# Altium schematic sheet ROBOTICARM.SchDoc
size 297 x 138 mm
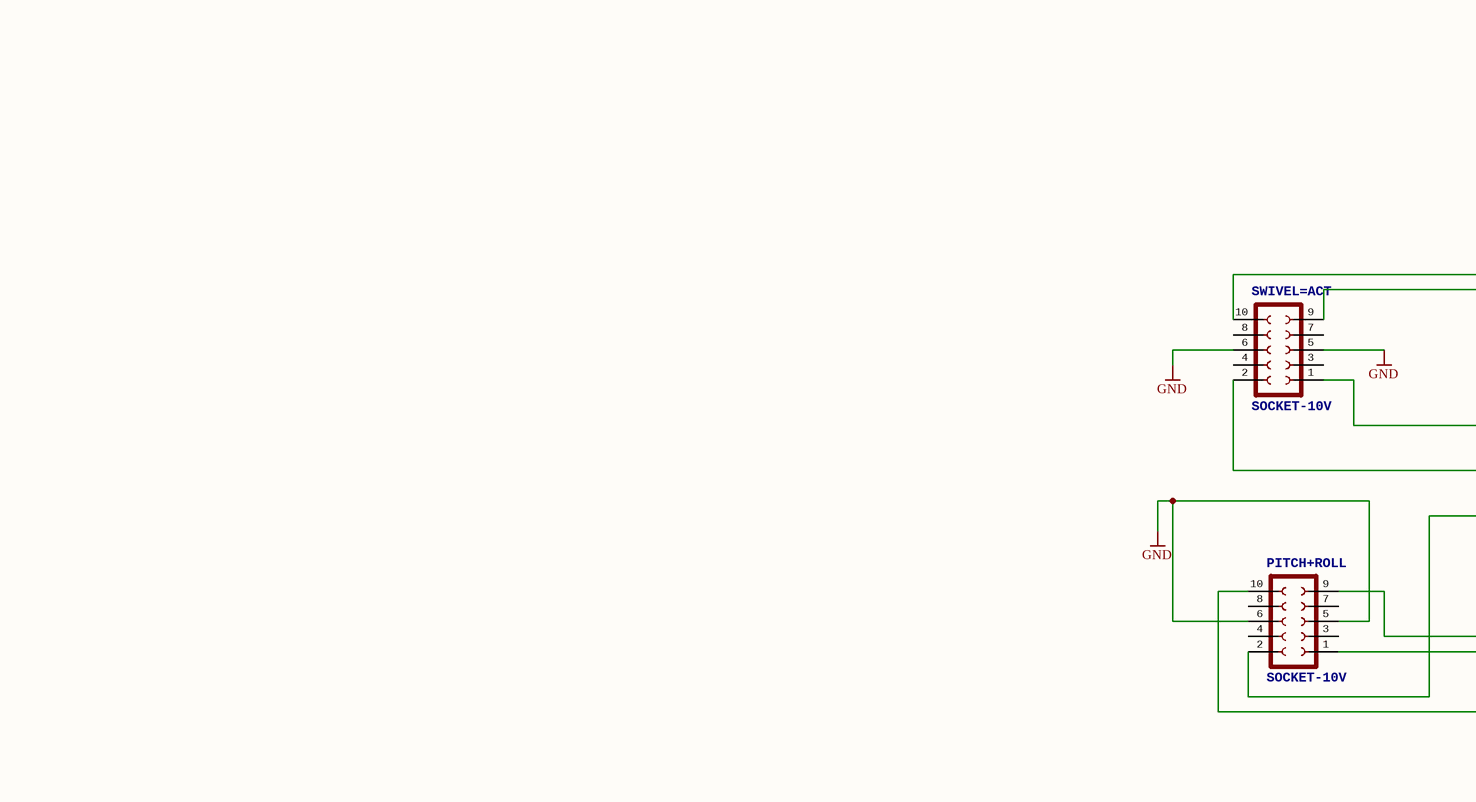
[diagram p0: ROBOTICARM.SchDoc, left]
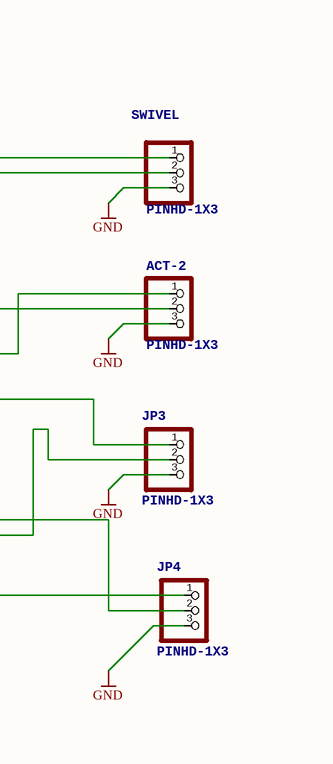
[diagram p1: ROBOTICARM.SchDoc, middle]

## Parts
ACT-2  PINHD-1X3  [1X03]
JP3  PINHD-1X3  [1X03]
JP4  PINHD-1X3  [1X03]
MRM1  MRMLogo: MRM Logo  [LOL]  (hidden comment: MRM)
PITCH+ROLL  SOCKET-10V  [S10V]
SWIVEL  PINHD-1X3  [1X03]
SWIVEL=ACT  SOCKET-10V  [S10V]

## Nets
GND: ACT-2.3 JP3.3 JP4.3 PITCH+ROLL.5 PITCH+ROLL.6 SWIVEL.3 SWIVEL=ACT.5 SWIVEL=ACT.6
NetACT-2_1: ACT-2.1 SWIVEL=ACT.2
NetACT-2_2: ACT-2.2 SWIVEL=ACT.1
NetJP3_1: JP3.1 PITCH+ROLL.2
NetJP3_2: JP3.2 PITCH+ROLL.1
NetJP4_1: JP4.1 PITCH+ROLL.10
NetJP4_2: JP4.2 PITCH+ROLL.9
NetSWIVEL_1: SWIVEL.1 SWIVEL=ACT.10
NetSWIVEL_2: SWIVEL.2 SWIVEL=ACT.9

Not connected (* = marked no-connect by the designer): PITCH+ROLL 3 4 7 8; SWIVEL=ACT 3 4 7 8

## Library data of the parts
ACT-2 JP3 JP4 SWIVEL = PINHD-1X3: PIN HEADER
PITCH+ROLL SWIVEL=ACT = SOCKET-10V: 10 pin PCB Socket (3m 85xx/51xx)